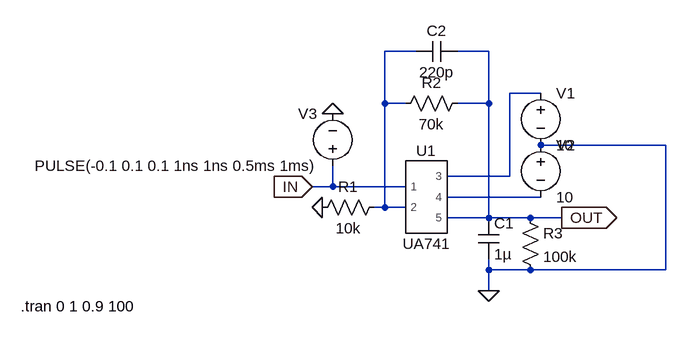
[diagram p0: schematic 运放稳定性.asc]
运放稳定性.asc, the LTspice schematic file:
Version 4
SHEET 1 880 680
WIRE 112 -80 64 -80
WIRE 224 -80 176 -80
WIRE 304 -16 256 -16
WIRE 64 0 64 -80
WIRE 96 0 64 0
WIRE 224 0 224 -80
WIRE 224 0 176 0
WIRE 496 64 304 64
WIRE 256 112 256 -16
WIRE 256 112 160 112
WIRE -16 128 -16 96
WIRE -16 128 -48 128
WIRE 96 128 -16 128
WIRE 304 144 160 144
WIRE 64 160 64 0
WIRE 64 160 48 160
WIRE 96 160 64 160
WIRE 224 176 224 0
WIRE 224 176 160 176
WIRE 288 176 224 176
WIRE 336 176 288 176
WIRE 224 256 224 240
WIRE 288 256 224 256
WIRE 496 256 496 64
WIRE 496 256 288 256
WIRE 224 288 224 256
FLAG 224 288 0
FLAG -32 160 0
FLAG -48 128 IN
IOPIN -48 128 In
FLAG 336 176 OUT
IOPIN 336 176 Out
FLAG -16 16 0
SYMBOL UA741 128 144 R0
SYMATTR InstName U1
SYMBOL res 64 144 R90
WINDOW 0 0 56 VBottom 2
WINDOW 3 32 56 VTop 2
SYMATTR InstName R1
SYMATTR Value 10k
SYMBOL res 192 -16 R90
WINDOW 0 0 56 VBottom 2
WINDOW 3 32 56 VTop 2
SYMATTR InstName R2
SYMATTR Value 70k
SYMBOL cap 208 176 R0
SYMATTR InstName C1
SYMATTR Value 1µ
SYMBOL res 272 160 R0
SYMATTR InstName R3
SYMATTR Value 100k
SYMBOL voltage 304 -32 R0
WINDOW 123 0 0 Left 0
WINDOW 39 0 0 Left 0
SYMATTR InstName V1
SYMATTR Value 10
SYMBOL voltage 304 48 R0
WINDOW 123 0 0 Left 0
WINDOW 39 0 0 Left 0
SYMATTR InstName V2
SYMATTR Value 10
SYMBOL voltage -16 112 R180
WINDOW 0 24 96 Left 2
WINDOW 3 24 16 Left 2
WINDOW 123 0 0 Left 0
WINDOW 39 0 0 Left 0
SYMATTR InstName V3
SYMATTR Value PULSE(-0.1 0.1 0.1 1ns 1ns 0.5ms 1ms)
SYMBOL cap 176 -96 R90
WINDOW 0 0 32 VBottom 2
WINDOW 3 32 32 VTop 2
SYMATTR InstName C2
SYMATTR Value 220p
TEXT -496 312 Left 2 !.tran 0 1 0.9 100

The netlist it stands for:
* 运放稳定性.asc
XU1 IN N001 N002 N003 OUT UA741  ; pins 1 2 3 4 5
R1 N001 0 10k
R2 OUT N001 70k
C1 OUT 0 1µ
R3 OUT 0 100k
V1 N002 0 10
V2 0 N003 10
V3 IN 0 PULSE(-0.1 0.1 0.1 1ns 1ns 0.5ms 1ms)
C2 OUT N001 220p
.tran 0 1 0.9 100
.lib C:\Users\Aristotle\Documents\LTspice\UA741.301
.backanno
.end